# Altium schematic sheet 5,12VSupply.SchDoc
size A4; SheetNumber: 10; SheetTotal: 11
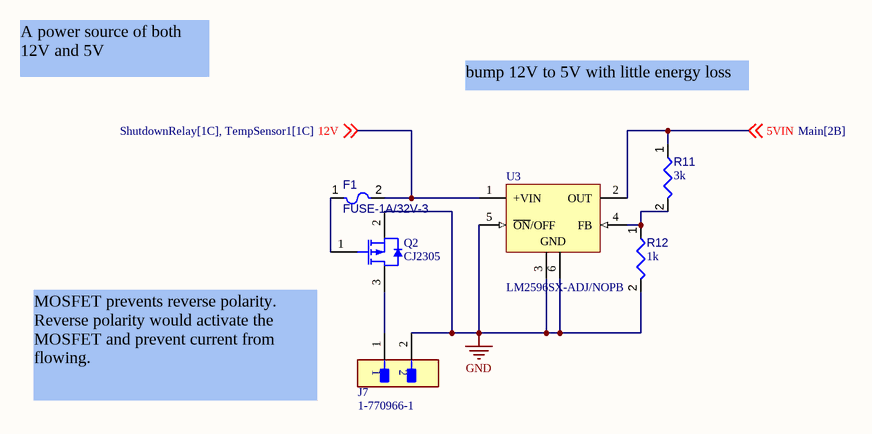
[diagram p0: 5,12VSupply.SchDoc]

## Parts
F1  FUSE-1A/32V-3  [LFUS-467_V]
J7  1-770966-1  [FP-1-770966-1-MFG]
Q2  CJ2305  [JSCJ-SOT23-3_V]
R11  value 3k  [RESC0402(1005)_L]  (hidden comment: 3KR2F)
R12  value 1k  [RESC0402(1005)_L]  (hidden comment: 1KR2J)
U3  LM2596SX-ADJ/NOPB  [KTT0005B_L]

## Nets
GND: J7.2 Q2.2(SOURCE) R12.2 U3.3(GND) U3.5(~{ON}/OFF) U3.6(GND)
5VIN: R11.1 U3.2(OUT) ; off-sheet 5VIN
12V: F1.2 U3.1(+VIN) ; off-sheet 12V
NetF1_1: F1.1 Q2.1(GATE)
NetJ7_1: J7.1 Q2.3(DRAIN)
NetR11_2: R11.2 R12.1 U3.4(FB)

## Notes on the sheet
- A power source of both 12V and 5V
- bump 12V to 5V with little energy loss
- MOSFET prevents reverse polarity. Reverse polarity would activate the MOSFET and prevent current from flowing.

## Library data of the parts
F1 = CMP-005-00012-2: Fast Acting Fuse, 1 A, 32 V, -55 to 90 degC, 2-Pin SMD, RoHS, Tape and Reel; Current Rating: 1A; Case/Package: LFUS-467; Pins: 2
J7 = CMP-03369-000082-1: CONN HEADER R/A 2POS 4.14MM; Manufacturer: TE; Current Rating: 9.5A; Standoff Height: 0.63mm; Conn Gender: Male; Voltage Rating: 600V; Number Of Contacts: 2; Conn Orientation: Right Angle; Device Class L3: unset; Pitch: 4.14mm; Height: 7.9mm; Temperature Range High: +105°C; Octopart: https://octopart.com/1-770966-1-te+connectivity-46506767; Automotive: No; Digikey Description: CONN HEADER R/A 2POS 4.14MM; ComponentLink2URL: https://www.te.com/usa-en/product-1-770966-1.html?te_bu=Cor&te_type=other&te_campaign=oct_glo_cor-oct-global-oth-prtnr-fy19-oct-octo-buy-bom_sma-298_2&elqCampaignId=35216; Category: Conn; Lead Free: Yes; Mouser Description: Pin & Socket Connectors HEADER 2 POS R/A GOLD IN-LINE; ComponentLink2Description: Datasheet; Contact Material: Gold,Tin,Nickel; Device Class L1: Connectors; Number Of Rows: 1; Device Class L2: Headers and Wire Housings; Package: 1-770966-1; RoHS: TRUE; Manufacturer Part Number: 1-770966-1; Temperature: -55°C to +105°C; Temperature Range Low: -55°C
Q2 = CMP-013-00015-3: P-Channel Plastic Encapsulate MOSFET, 12 V, 4.1 A, 3-Pin SOT23, Tape and Reel; Manufacturer: Jiangsu Changjiang Electronics Technology; Package Version: Rev. E, 09/2009; Datasheet URL: http://www.cj-elec.com/gallery/txUpfile/5140ba9ed47d18467ea4bddc055cd747.pdf; Case/Package: SOT23-3; Mounting Technology: SM; RoHS Compliant: Unknown; Datasheet Version: Rev. F, 04/2015; Package Description: 3-Pin Small Outline Transistor, Body 2.9 x 1.3 mm, Pitch 0.95 mm; Package Reference: SOT23-3
R11 = CMP-009-00099-2: 3K 0.063W 1% 0402 (1005 Metric)  SMD; Power: 63mW; Case/Package: 0402; Tolerance: 1%; Mounting Technology: SMT; Pins: 2
R12 = CMP-009-00075-2: 1K 0.063W 5% 0402 (1005 Metric)  SMD; Power: 63mW; Pins: 2; Mounting Technology: SMT; Case/Package: 0402; Tolerance: 5%
U3 = CMP-2000-06545-1: Simple Switcher(R) Power Converter 150 kHz Step-Down Voltage Regulator, 3 A, 4.5 to 40 V, -40 to 125 degC, 5-Pin TO-263 (KTT), Green (RoHS & no Sb/Br), Tape and Reel; PartNumber: LM2596; Manufacturer: Texas Instruments; Package Version: 4200577-4/G, 01/2013; Primary Input Voltage: 40V; No. of Outputs: 1; No. of Pins: 5; SVHC: NoSVHC(19-Dec-2012); Output Voltage: 37V; Output Current: 3A; Datasheet Version: Rev. C, 04/2013; Package Reference: KTT5; MSL: MSL3-168hours; Number of Outputs: 1; Operating Temperature Min: -40°C; Operating Temperature Range: -40°Cto+125°C; Manufacturer URL: http://www.ti.com/; Package URL: http://www.ti.com/litv/pdf/mpsf007e; Voltage Regulator Case Style: TO-263; Operating Temperature Max: 125°C; Package Description: 5-Pin Plastic Flange Mount, Body 10.16 x 8.925 mm, Pitch 1.7 mm; Datasheet URL: http://www.ti.com/lit/ds/symlink/lm2596.pdf; Mounting Technology: SurfaceMount